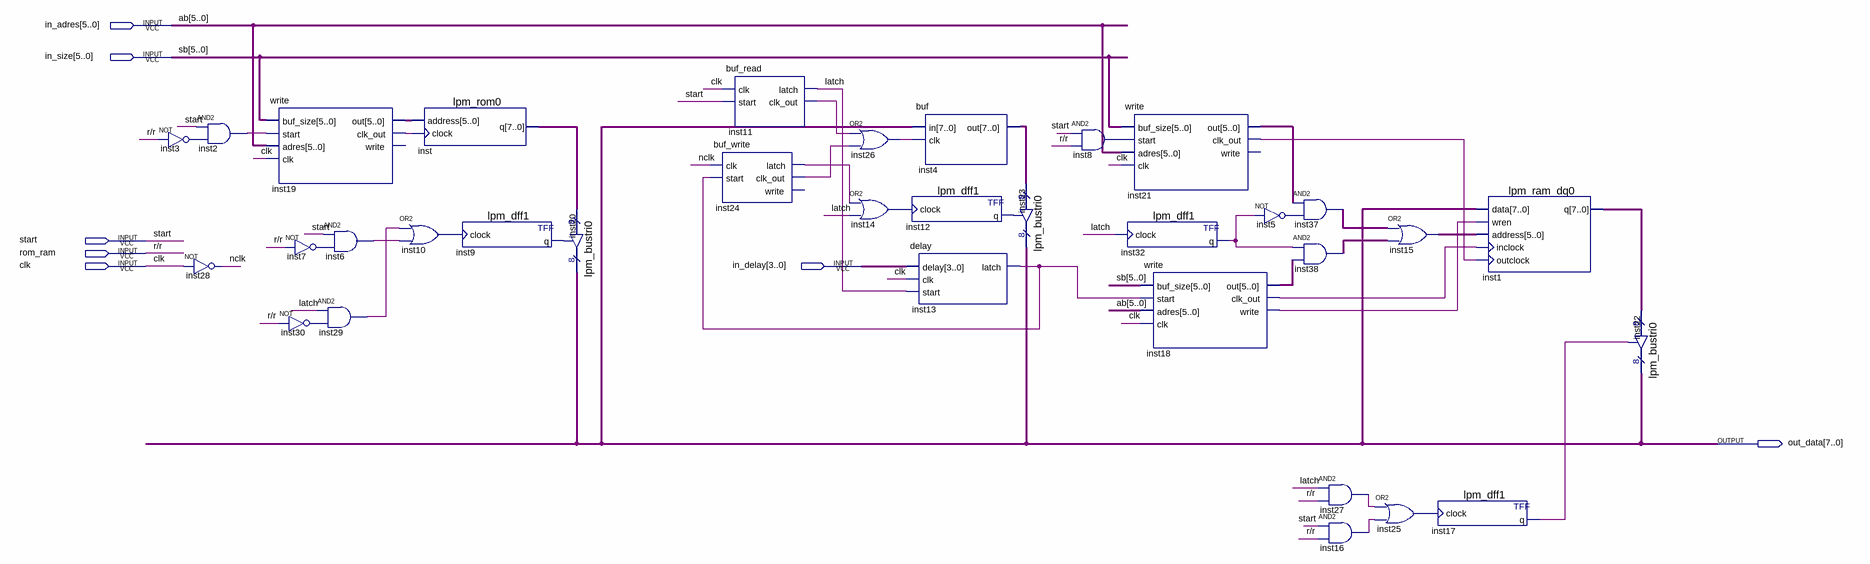
[diagram p0: schematic sheet]
// Quartus schematic lab3.bdf as structural Verilog: 34 symbols, 7 pins
module lab3 (
  input  [5:0] in_adres,
  input  [5:0] in_size,
  input  start,
  input  rom_ram,
  input  clk,
  input  [3:0] in_delay,
  output [7:0] out_data
);

  wire inst2_out, inst3_out, inst5_out, inst6_out, inst7_out, inst8_out, inst9_q, inst10_out, inst11_clk_out,
       inst12_q, inst13_latch, inst14_out, inst16_out, inst17_q, inst18_clk_out, inst18_write,
       inst19_clk_out, inst21_clk_out, inst24_clk_out, inst24_latch, inst25_out, inst26_out, inst27_out,
       inst29_out, inst30_out, inst32_q, latch, nclk;
  wire [5:0] inst15_out, inst18_out, inst19_out, inst21_out, inst37_out, inst38_out;
  wire [7:0] inst1_q, inst4_out, inst_q;

  not inst3 (inst3_out, rom_ram);
  and inst2 (inst2_out, start, inst3_out);
  not inst28 (nclk, clk);
  write inst19 (
    .buf_size(in_size), .start(inst2_out), .adres(in_adres), .clk(clk), .out(inst19_out),
    .clk_out(inst19_clk_out));  // open: write
  and inst6 (inst6_out, start, inst7_out);
  not inst7 (inst7_out, rom_ram);
  and inst29 (inst29_out, latch, inst30_out);
  not inst30 (inst30_out, rom_ram);
  lpm_rom0 inst (.address(inst19_out), .clock(inst19_clk_out), .q(inst_q));
  or inst10 (inst10_out, inst29_out, inst6_out);
  lpm_dff1 inst9 (.clock(inst10_out), .q(inst9_q));
  lpm_bustri0 inst20 (.enabledt(inst9_q), .data(inst_q), .tridata(out_data));
  buf_read inst11 (.clk(clk), .start(start), .latch(latch), .clk_out(inst11_clk_out));
  buf_write inst24 (.clk(nclk), .start(inst13_latch), .latch(inst24_latch), .clk_out(inst24_clk_out));  // open: write
  or inst26 (inst26_out, inst11_clk_out, inst24_clk_out);
  or inst14 (inst14_out, inst24_latch, latch);
  \buf  inst4 (.in(out_data), .clk(inst26_out), .out(inst4_out));
  lpm_dff1 inst12 (.clock(inst14_out), .q(inst12_q));
  delay inst13 (.delay(in_delay), .clk(clk), .start(latch), .latch(inst13_latch));
  lpm_bustri0 inst23 (.enabledt(inst12_q), .data(inst4_out), .tridata(out_data));
  and inst8 (inst8_out, start, rom_ram);
  write inst21 (
    .buf_size(in_size), .start(inst8_out), .adres(in_adres), .clk(clk), .out(inst21_out),
    .clk_out(inst21_clk_out));  // open: write
  lpm_dff1 inst32 (.clock(latch), .q(inst32_q));
  write inst18 (
    .buf_size(in_size), .start(inst13_latch), .adres(in_adres), .clk(clk), .out(inst18_out),
    .clk_out(inst18_clk_out), .write(inst18_write));
  not inst5 (inst5_out, inst32_q);
  assign inst37_out = inst21_out & {6{inst5_out}};  // AND2 inst37, 6 bits wide
  assign inst38_out = {6{inst32_q}} & inst18_out;  // AND2 inst38, 6 bits wide
  and inst27 (inst27_out, latch, rom_ram);
  and inst16 (inst16_out, start, rom_ram);
  assign inst15_out = inst37_out | inst38_out;  // OR2 inst15, 6 bits wide
  or inst25 (inst25_out, inst27_out, inst16_out);
  lpm_dff1 inst17 (.clock(inst25_out), .q(inst17_q));
  lpm_ram_dq0 inst1 (
    .data(out_data), .wren(inst18_write), .address(inst15_out), .inclock(inst18_clk_out),
    .outclock(inst21_clk_out), .q(inst1_q));
  lpm_bustri0 inst22 (.enabledt(inst17_q), .data(inst1_q), .tridata(out_data));

  // Other names for the same wires on the sheet: ab[5:0] = in_adres; r/r = rom_ram; sb[5:0] = in_size
endmodule
